# Altium project MP2359-3.3v.PrjPcb
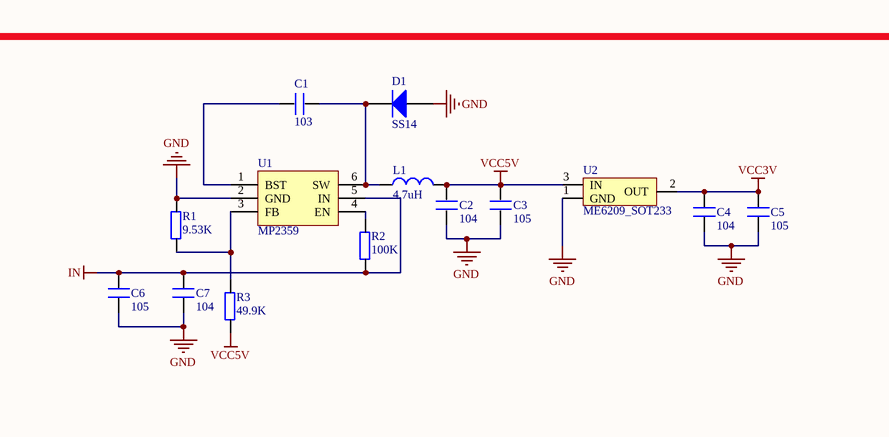
[diagram p0: MP2359-3.3v.SchDoc, left]
1 sheet, 14 parts. Net scope: global (net labels, ports and power ports of the same name join across sheets).
Board file: MP2359-3.3v.PcbDoc

## Sheet MP2359-3.3v.SchDoc
size A2

### Parts
C1  103  [C_0805]
C2  104  [C_0805]
C3  105  [C_0805]
C4  104  [C_0805]
C5  105  [C_0805]
C6  105  [C_0805]
C7  104  [C_0805]
D1  Type: SS14  [DIODE-SMA]  (hidden comment: Diode)
L1  value 4.7uH  [L-SMD-7]  (hidden comment: Inductor)
R1  9.53K  [R0805]
R2  100K  [R0805]
R3  49.9K  [R0805]
U1  MP2359  [SOT23-6]
U2  ME6209_SOT233  [SOT-23 - duplicate1]

### Nets
GND: C2.1 C3.1 C4.1 C5.1 C6.1 C7.1 D1.1(A) R1.1 U1.2(GND) U2.1(GND)
IN: C6.2 C7.2 R2.2 U1.5(IN)
VCC3V: C4.2 C5.2 U2.2(OUT)
VCC5V: C2.2 C3.2 L1.2 R3.2 U2.3(IN)
NetC1_1: C1.1 U1.1(BST)
NetC1_2: C1.2 D1.2(K) L1.1 U1.6(SW)
NetR1_2: R1.2 R3.1 U1.3(FB)
NetR2_1: R2.1 U1.4(EN)

### Library data of the parts
C1-C7 = C
D1 = Diode: 二极管; Published: 8-Jun-2000; LatestRevisionDate: 17-Jul-2002; LatestRevisionNote: Re-released for DXP Platform.; PackageDocument: Sep-1996; PackageReference: SMC; Publisher: Altium Limited; Code_JEDEC: DO-214-AB
L1 = Inductor: 电感; Code_IEC: 1005; Published: 8-Jun-2000; LatestRevisionDate: 17-Jul-2002; LatestRevisionNote: Re-released for DXP Platform.; PackageReference: 0402-A; Publisher: Altium Limited; Code_JEITA: 0402
R1-R3 = R
U2 = ME6209